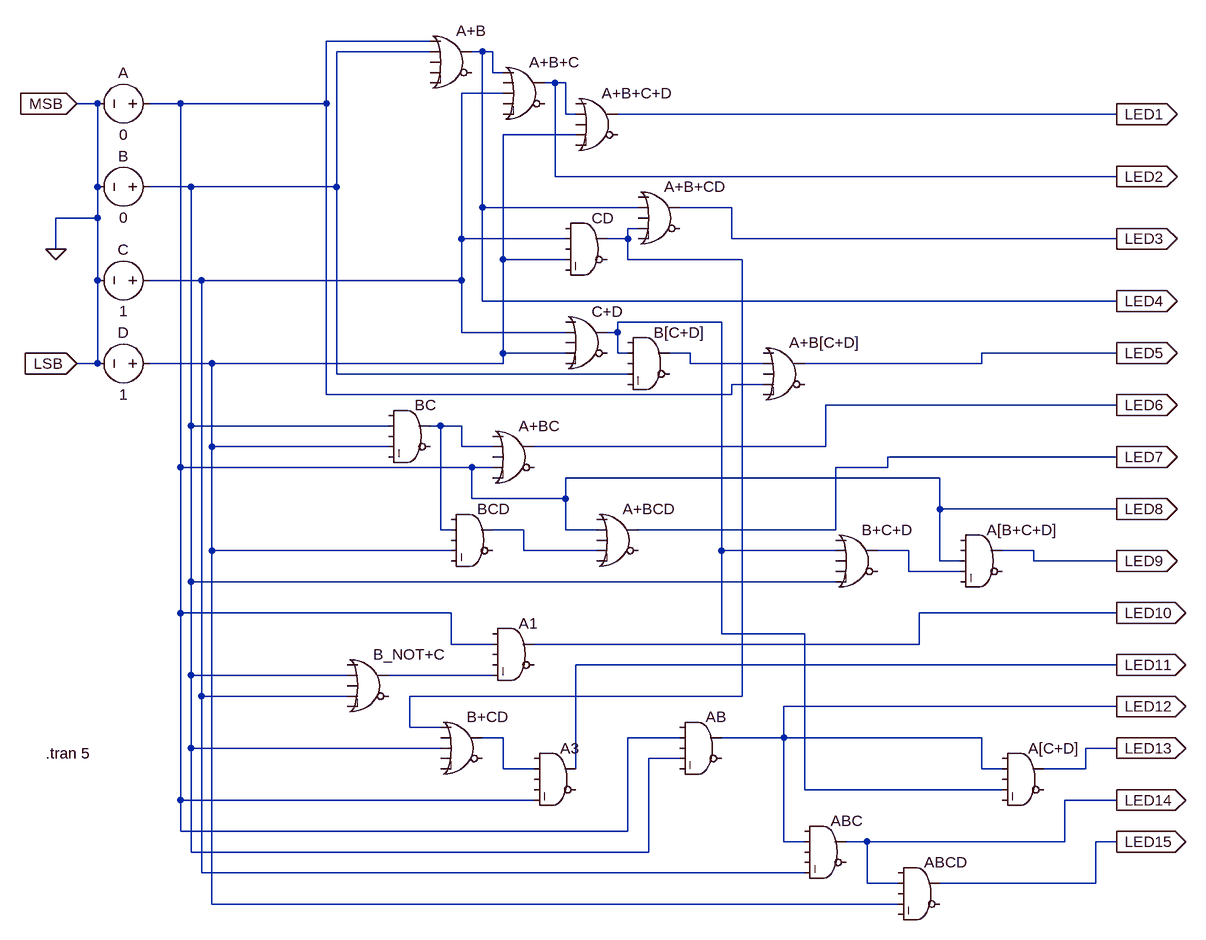
[diagram p0: schematic 4bitSch.asc]
4bitSch.asc, the LTspice schematic file:
Version 4.1
SHEET 1 1652 1568
WIRE 464 -240 304 -240
WIRE 464 -224 320 -224
WIRE 544 -224 528 -224
WIRE 560 -224 544 -224
WIRE 560 -192 560 -224
WIRE 576 -192 560 -192
WIRE 656 -176 640 -176
WIRE 672 -176 656 -176
WIRE 576 -160 512 -160
WIRE -48 -144 -80 -144
WIRE 80 -144 32 -144
WIRE 304 -144 304 -240
WIRE 304 -144 80 -144
WIRE 672 -128 672 -176
WIRE 688 -128 672 -128
WIRE 1520 -128 752 -128
WIRE 688 -96 576 -96
WIRE 656 -32 656 -176
WIRE 1520 -32 656 -32
WIRE -48 -16 -48 -144
WIRE 96 -16 32 -16
WIRE 320 -16 320 -224
WIRE 320 -16 96 -16
WIRE 544 16 544 -224
WIRE 784 16 544 16
WIRE 928 16 848 16
WIRE -48 32 -48 -16
WIRE -48 32 -112 32
WIRE 784 48 768 48
WIRE 512 64 512 -160
WIRE 672 64 512 64
WIRE 768 64 768 48
WIRE 768 64 736 64
WIRE 928 64 928 16
WIRE 1520 64 928 64
WIRE -112 80 -112 32
WIRE 576 96 576 -96
WIRE 672 96 576 96
WIRE 768 96 768 64
WIRE 944 96 768 96
WIRE -48 128 -48 32
WIRE 112 128 32 128
WIRE 512 128 512 64
WIRE 512 128 112 128
WIRE 544 160 544 16
WIRE 1520 160 544 160
WIRE 912 192 752 192
WIRE 512 208 512 128
WIRE 672 208 512 208
WIRE 752 208 752 192
WIRE 752 208 736 208
WIRE 576 240 576 96
WIRE 672 240 576 240
WIRE 752 240 752 208
WIRE 768 240 752 240
WIRE 864 240 832 240
WIRE 1520 240 1312 240
WIRE -48 256 -48 128
WIRE -48 256 -80 256
WIRE 128 256 32 256
WIRE 576 256 576 240
WIRE 576 256 128 256
WIRE 864 256 864 240
WIRE 976 256 864 256
WIRE 1312 256 1312 240
WIRE 1312 256 1040 256
WIRE 320 272 320 -16
WIRE 768 272 320 272
WIRE 976 288 928 288
WIRE 304 304 304 -144
WIRE 928 304 928 288
WIRE 928 304 304 304
WIRE 1520 320 1072 320
WIRE 96 352 96 -16
WIRE 400 352 96 352
WIRE 480 352 464 352
WIRE 512 352 480 352
WIRE 128 384 128 256
WIRE 400 384 128 384
WIRE 512 384 512 352
WIRE 560 384 512 384
WIRE 1072 384 1072 320
WIRE 1072 384 624 384
WIRE 1520 400 1168 400
WIRE 80 416 80 -144
WIRE 528 416 80 416
WIRE 560 416 528 416
WIRE 1168 416 1168 400
WIRE 1168 416 1088 416
WIRE 1248 432 672 432
WIRE 528 464 528 416
WIRE 672 464 672 432
WIRE 672 464 528 464
WIRE 1248 480 1248 432
WIRE 1520 480 1248 480
WIRE 480 512 480 352
WIRE 496 512 480 512
WIRE 608 512 560 512
WIRE 672 512 672 464
WIRE 720 512 672 512
WIRE 1088 512 1088 416
WIRE 1088 512 784 512
WIRE 128 544 128 384
WIRE 496 544 128 544
WIRE 608 544 608 512
WIRE 720 544 608 544
WIRE 912 544 912 192
WIRE 1088 544 912 544
WIRE 1200 544 1152 544
WIRE 1392 544 1344 544
WIRE 1248 560 1248 480
WIRE 1280 560 1248 560
WIRE 1392 560 1392 544
WIRE 1520 560 1392 560
WIRE 1200 576 1200 544
WIRE 1280 576 1200 576
WIRE 96 592 96 352
WIRE 1088 592 96 592
WIRE 80 640 80 416
WIRE 496 640 80 640
WIRE 1520 640 1216 640
WIRE 912 672 912 544
WIRE 1040 672 912 672
WIRE 496 688 496 640
WIRE 560 688 496 688
WIRE 1216 688 1216 640
WIRE 1216 688 624 688
WIRE 1520 720 688 720
WIRE 96 736 96 592
WIRE 336 736 96 736
WIRE 560 736 400 736
WIRE 112 768 112 128
WIRE 336 768 112 768
WIRE 944 768 944 96
WIRE 944 768 432 768
WIRE 1520 784 1008 784
WIRE 432 816 432 768
WIRE 480 816 432 816
WIRE 576 832 544 832
WIRE 848 832 768 832
WIRE 1008 832 1008 784
WIRE 1008 832 912 832
WIRE 1312 832 1008 832
WIRE 96 848 96 736
WIRE 480 848 96 848
WIRE 1520 848 1472 848
WIRE 848 864 800 864
WIRE 576 880 576 832
WIRE 624 880 576 880
WIRE 688 880 688 720
WIRE 1312 880 1312 832
WIRE 1344 880 1312 880
WIRE 1472 880 1472 848
WIRE 1472 880 1408 880
WIRE 1040 912 1040 672
WIRE 1344 912 1040 912
WIRE 80 928 80 640
WIRE 624 928 80 928
WIRE 1520 928 1440 928
WIRE 80 976 80 928
WIRE 768 976 768 832
WIRE 768 976 80 976
WIRE 1008 992 1008 832
WIRE 1040 992 1008 992
WIRE 1136 992 1104 992
WIRE 1440 992 1440 928
WIRE 1440 992 1136 992
WIRE 1520 992 1488 992
WIRE 96 1008 96 848
WIRE 800 1008 800 864
WIRE 800 1008 96 1008
WIRE 112 1040 112 768
WIRE 1040 1040 112 1040
WIRE 1136 1056 1136 992
WIRE 1184 1056 1136 1056
WIRE 1488 1056 1488 992
WIRE 1488 1056 1248 1056
WIRE 128 1088 128 544
WIRE 1184 1088 128 1088
FLAG -112 80 0
FLAG 1520 -128 LED1
IOPIN 1520 -128 Out
FLAG 1520 -32 LED2
IOPIN 1520 -32 Out
FLAG 1520 64 LED3
IOPIN 1520 64 Out
FLAG 1520 160 LED4
IOPIN 1520 160 Out
FLAG 1520 240 LED5
IOPIN 1520 240 Out
FLAG 1520 320 LED6
IOPIN 1520 320 Out
FLAG 1520 400 LED7
IOPIN 1520 400 Out
FLAG 1520 480 LED8
IOPIN 1520 480 Out
FLAG 1520 560 LED9
IOPIN 1520 560 Out
FLAG 1520 640 LED10
IOPIN 1520 640 Out
FLAG -80 -144 MSB
IOPIN -80 -144 In
FLAG -80 256 LSB
IOPIN -80 256 In
FLAG 1520 720 LED11
IOPIN 1520 720 Out
FLAG 1520 784 LED12
IOPIN 1520 784 Out
FLAG 1520 848 LED13
IOPIN 1520 848 Out
FLAG 1520 928 LED14
IOPIN 1520 928 Out
FLAG 1520 992 LED15
IOPIN 1520 992 Out
DATAFLAG 48 -144 ""
DATAFLAG 48 -16 ""
DATAFLAG 48 128 ""
DATAFLAG 64 256 ""
SYMBOL voltage 48 128 R90
WINDOW 0 -32 56 VBottom 2
WINDOW 3 32 56 VTop 2
WINDOW 123 0 0 Left 0
WINDOW 39 0 0 Left 0
SYMATTR InstName C
SYMATTR Value 1
SYMBOL voltage 48 -16 R90
WINDOW 0 -32 56 VBottom 2
WINDOW 3 32 56 VTop 2
WINDOW 123 0 0 Left 0
WINDOW 39 0 0 Left 0
SYMATTR InstName B
SYMATTR Value 0
SYMBOL voltage 48 -144 R90
WINDOW 0 -32 56 VBottom 2
WINDOW 3 32 56 VTop 2
WINDOW 123 0 0 Left 0
WINDOW 39 0 0 Left 0
SYMATTR InstName A
SYMATTR Value 0
SYMBOL voltage 48 256 R90
WINDOW 0 -32 56 VBottom 2
WINDOW 3 32 56 VTop 2
WINDOW 123 0 0 Left 0
WINDOW 39 0 0 Left 0
SYMATTR InstName D
SYMATTR Value 1
SYMBOL Digital\\or 496 -272 R0
SYMATTR InstName A+B
SYMBOL Digital\\or 608 -224 R0
SYMATTR InstName A+B+C
SYMBOL Digital\\or 720 -176 R0
SYMATTR InstName A+B+C+D
SYMBOL Digital\\and 704 16 R0
SYMATTR InstName CD
SYMBOL Digital\\or 816 -32 R0
SYMATTR InstName A+B+CD
SYMBOL Digital\\or 704 160 R0
SYMATTR InstName C+D
SYMBOL Digital\\and 800 192 R0
SYMATTR InstName B[C+D]
SYMBOL Digital\\or 1008 208 R0
SYMATTR InstName A+B[C+D]
SYMBOL Digital\\or 592 336 R0
SYMATTR InstName A+BC
SYMBOL Digital\\and 432 304 R0
SYMATTR InstName BC
SYMBOL Digital\\and 528 464 R0
SYMATTR InstName BCD
SYMBOL Digital\\or 752 464 R0
SYMATTR InstName A+BCD
SYMBOL Digital\\or 368 688 R0
SYMATTR InstName B_NOT+C
SYMBOL Digital\\and 592 640 R0
SYMATTR InstName A1
SYMBOL Digital\\and 880 784 R0
SYMATTR InstName AB
SYMBOL Digital\\and 1376 832 R0
SYMATTR InstName A[C+D]
SYMBOL Digital\\and 1072 944 R0
SYMATTR InstName ABC
SYMBOL Digital\\and 1216 1008 R0
SYMATTR InstName ABCD
SYMBOL Digital\\or 1120 496 R0
SYMATTR InstName B+C+D
SYMBOL Digital\\and 1312 496 R0
SYMATTR InstName A[B+C+D]
SYMBOL Digital\\or 512 784 R0
SYMATTR InstName B+CD
SYMBOL Digital\\and 656 832 R0
SYMATTR InstName A3
TEXT -128 856 Left 2 !.tran 5

The netlist it stands for:
* 4bitSch.asc
V§C N002 0 1
V§B N001 0 0
V§A LED8 0 0
V§D N003 0 1
A+B LED8 N001 0 0 0 0 LED4 0 OR
A+B+C LED4 0 N002 0 0 0 LED2 0 OR
A+B+C+D 0 LED2 0 N003 0 0 LED1 0 OR
A§CD 0 N002 0 N003 0 0 N004 0 AND
A+B+CD 0 LED4 0 N004 0 0 LED3 0 OR
A§C+D 0 N002 0 N003 0 0 N005 0 OR
A§B[C+D] 0 N005 0 N001 0 0 N006 0 AND
A+B[C+D] 0 N006 0 LED8 0 0 LED5 0 OR
A+BC 0 N007 0 LED8 0 0 LED6 0 OR
A§BC 0 N001 0 N003 0 0 N007 0 AND
A§BCD 0 N007 0 N003 0 0 N008 0 AND
A+BCD 0 LED8 0 N008 0 0 LED7 0 OR
A§B_NOT+C 0 N001 0 N002 0 0 N010 0 OR
A1 0 LED8 0 0 N010 0 LED10 0 AND
AB 0 LED8 0 N001 0 0 LED12 0 AND
A[C+D] 0 LED12 0 N005 0 0 LED13 0 AND
ABC 0 LED12 0 0 N002 0 LED14 0 AND
ABCD 0 LED14 0 N003 0 0 LED15 0 AND
A§B+C+D 0 N005 0 0 N001 0 N009 0 OR
A[B+C+D] 0 0 LED8 N009 0 0 LED9 0 AND
A§B+CD N004 0 N001 0 0 0 N011 0 OR
A3 0 N011 0 0 LED8 0 LED11 0 AND
.tran 5
.backanno
.end